# Altium schematic sheet Interface.SchDoc
size A4
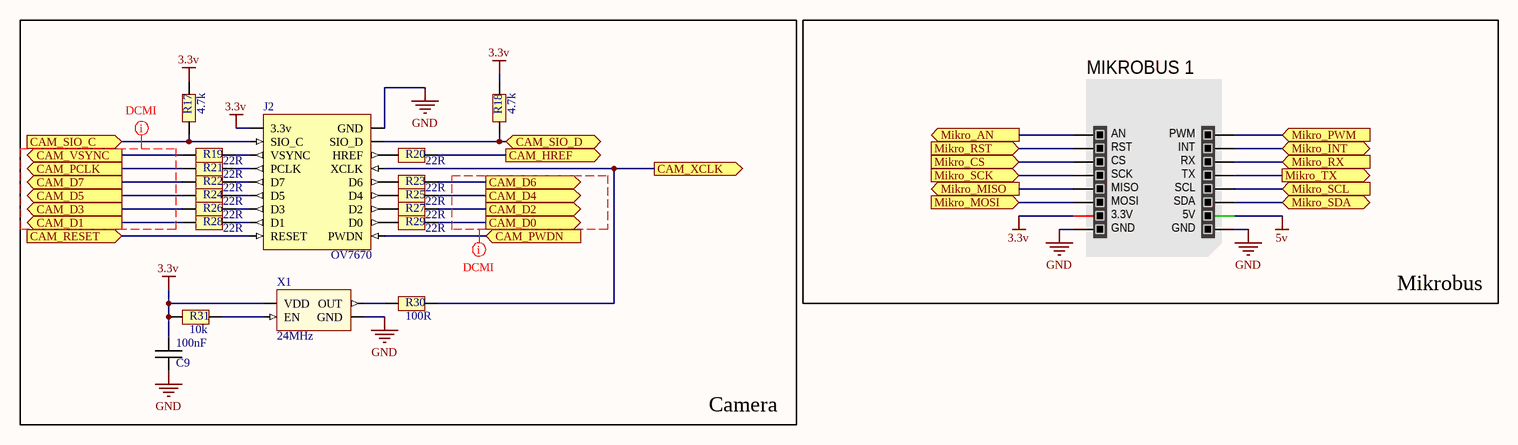
[diagram p0: Interface.SchDoc]

## Parts
C9  100nF  [0603]
J2  OV7670  [Header_2.54_2rang]
MIKROBUS_1  MIKROBUS HOST CONN.  [MIKROBUS HOST CONN.]  (value not drawn)
R17  4.7k  [0603]
R18  4.7k  [0603]
R19  22R  [0603]
R20  22R  [0603]
R21  22R  [0603]
R22  22R  [0603]
R23  22R  [0603]
R24  22R  [0603]
R25  22R  [0603]
R26  22R  [0603]
R27  22R  [0603]
R28  22R  [0603]
R29  22R  [0603]
R30  100R  [0603]
R31  10k  [0603]
X1  24MHz  [Oscillateur]

## Blocks framed on the sheet
Camera: C9 J2 R17-R31 X1
Mikrobus: MIKROBUS_1

## Ports
CAM_D0 (out), CAM_D1 (out), CAM_D2 (out), CAM_D3 (out), CAM_D4 (out), CAM_D5 (out), CAM_D6 (out), CAM_D7 (out), CAM_HREF (out), CAM_PCLK (out), CAM_PWDN (in), CAM_RESET (in), CAM_SIO_C (in), CAM_SIO_D (bidir), CAM_VSYNC (out), CAM_XCLK (out), Mikro_AN (out), Mikro_CS (in), Mikro_INT (bidir), Mikro_MISO (out), Mikro_MOSI (in), Mikro_PWM (in), Mikro_RST (in), Mikro_RX (in), Mikro_SCK (in), Mikro_SCL (in), Mikro_SDA (bidir), Mikro_TX (out)

## Nets
3.3v: C9.2 J2.1(3.3v) MIKROBUS_1.7(3.3V) R17.2 R18.2 R31.1 X1.4(VDD)
5v: MIKROBUS_1.10(5V)
GND: C9.1 J2.2(GND) MIKROBUS_1.8(GND) MIKROBUS_1.9(GND) X1.2(GND)
CAM_D0: R29.2 ; port CAM_D0
CAM_D1: R28.1 ; port CAM_D1
CAM_D2: R27.2 ; port CAM_D2
CAM_D3: R26.1 ; port CAM_D3
CAM_D4: R25.2 ; port CAM_D4
CAM_D5: R24.1 ; port CAM_D5
CAM_D6: R23.2 ; port CAM_D6
CAM_D7: R22.1 ; port CAM_D7
CAM_HREF: R20.2 ; port CAM_HREF
CAM_PCLK: R21.1 ; port CAM_PCLK
CAM_PWDN: J2.18(PWDN) ; port CAM_PWDN
CAM_RESET: J2.17(RESET) ; port CAM_RESET
CAM_SIO_C: J2.3(SIO_C) R17.1 ; port CAM_SIO_C
CAM_SIO_D: J2.4(SIO_D) R18.1 ; port CAM_SIO_D
CAM_VSYNC: R19.1 ; port CAM_VSYNC
CAM_XCLK: J2.8(XCLK) R30.2 ; port CAM_XCLK
Mikro_AN: MIKROBUS_1.1(AN) ; port Mikro_AN
Mikro_CS: MIKROBUS_1.3(CS) ; port Mikro_CS
Mikro_INT: MIKROBUS_1.15(INT) ; port Mikro_INT
Mikro_MISO: MIKROBUS_1.5(MISO) ; port Mikro_MISO
Mikro_MOSI: MIKROBUS_1.6(MOSI) ; port Mikro_MOSI
Mikro_PWM: MIKROBUS_1.16(PWM) ; port Mikro_PWM
Mikro_RST: MIKROBUS_1.2(RST) ; port Mikro_RST
Mikro_RX: MIKROBUS_1.14(RX) ; port Mikro_RX
Mikro_SCK: MIKROBUS_1.4(SCK) ; port Mikro_SCK
Mikro_SCL: MIKROBUS_1.12(SCL) ; port Mikro_SCL
Mikro_SDA: MIKROBUS_1.11(SDA) ; port Mikro_SDA
Mikro_TX: MIKROBUS_1.13(TX) ; port Mikro_TX
NetJ2_5: J2.5(VSYNC) R19.2
NetJ2_6: J2.6(HREF) R20.1
NetJ2_7: J2.7(PCLK) R21.2
NetJ2_9: J2.9(D7) R22.2
NetJ2_10: J2.10(D6) R23.1
NetJ2_11: J2.11(D5) R24.2
NetJ2_12: J2.12(D4) R25.1
NetJ2_13: J2.13(D3) R26.2
NetJ2_14: J2.14(D2) R27.1
NetJ2_15: J2.15(D1) R28.2
NetJ2_16: J2.16(D0) R29.1
NetR30_1: R30.1 X1.3(OUT)
NetR31_2: R31.2 X1.1(EN)

## Layout directives
rule Matched Net Lengths [Tolerance = 2mm]; net class DCMI: (no net found under the mark)

## Library data of the parts
C9 = Capa
J2 = OV7670: Manufacturer 1: Samtec; Manufacturer Part Number 1: SSW-109-01-T-D; Max Current Rating: 6.9A; Contact Resistance: 10mR; Connector Type: Receptacle,Socket; Number of Positions: 18; Gender: Receptacle; Max Voltage Rating (AC): 550V; Mating Cycles: 100; Pitch: 2.54mm; Row Spacing: 0.1inch; Supplier 1: Mouser; Stock 1: 163; Pricing 1: 1=1,58000, 10=1,31000, 100=0,98000, 250=0,92500, 500=0,81600, 1000=0,72400 (USD); RoHS: Yes; Mount: Through Hole; Contact Plating: Tin,Matte; Contact Material: Bronze; Color: Black; Housing Color: Black; Housing Material: Polymer; Min Operating Temperature: -55°C; Max Operating Temperature: 105°C; Packaging: Bulk; Termination: Solder; Number of Rows: 2; Number of Contacts: 18; Orientation: Vertical; Length: 23.37mm; Depth: 4.95mm; Width: 4.95mm; Radiation Hardening: No; REACH SVHC: No SVHC; Lead Free: Lead Free; ComponentLink1URL: https://datasheet.ciiva.com/750/ssw-1xx-xx-xxx-x-xx-xxx-xx-mkt-750020.pdf?src-supplier=Digi-Key; ComponentLink1Description: https://datasheet.ciiva.com/750/ssw-1xx-xx-xxx-x-xx-xxx-xx-mkt-750020.pdf?src-supplier=Digi-Key; Supplier Part Number 1: 200-SSW10901TD
MIKROBUS_1 = MIKROBUS HOST CONN._1: mikroBUS Host Socket; Manufacturer 1: Multicomp; Manufacturer Part Number 1: 2212S-08SG-85; Gender: Receptacle; Number of Contacts: 8; Insulation Resistance: 1GR; SMD: No; Supplier 1: Farnell; Stock 1: 60017; Pricing 1: 15=0,18900, 150=0,13900, 500=0,12000, 1000=0,09780, 1500=0,09440, 5000=0,09090, 10000=0,08730, 20000=0,08380 (EUR); RoHS: Yes; Mount: Through Hole; Weight: 0.11lb; Contact Plating: Gold; Contact Material: Copper Alloy; Number of Rows: 1; Termination: Through Hole; Length: 0.83inch; Height: 0.35inch; Width: 0.12inch; REACH SVHC: No SVHC; Flammability Rating: UL94 V-0; ComponentLink1URL: https://datasheet.ciiva.com/1434/1662126-1434005.pdf?src-supplier=Element14; ComponentLink1Description: https://datasheet.ciiva.com/1434/1662126-1434005.pdf?src-supplier=Element14; Supplier Part Number 1: 1593463
R17-R31 = Resistance
X1 = Oscillateur: Manufacturer 1: Kyocera AVX; Manufacturer Part Number 1: KC2520B24.0000C10E00; Load Capacitance: 15pF; Max Supply Voltage: 3.63V; Min Supply Voltage: 1.6V; Frequency Tolerance: 50ppm; Current Rating: 3.5mA; Max Duty Cycle: 55%; Supplier 1: Mouser; Stock 1: 7192; Pricing 1: 1=1,34000, 10=1,28000, 50=1,26000, 100=1,07000, 500=1,04000, 1000=0,84100, 2000=0,79800, 10000=0,79600 (USD); RoHS: Yes; Mount: Surface Mount; Case/Package: CSMD; Number of Pins: 4; Min Operating Temperature: -10°C; Max Operating Temperature: 70°C; Packaging: Tape and Reel; Frequency: 24MHz; Package Quantity: 2000; Frequency Stability: 50ppm; Termination: SMD/SMT; Max Supply Current: 3.5mA; Length: 2.5mm; Height: 0.028inch; Width: 2mm; Depth: 2mm; Radiation Hardening: No; REACH SVHC: Unknown; Lead Free: Lead Free; ComponentLink1URL: https://datasheet.ciiva.com/7061/1794171-7061531.pdf?src-supplier=Newark; ComponentLink1Description: https://datasheet.ciiva.com/7061/1794171-7061531.pdf?src-supplier=Newark; Supplier Part Number 1: 581-KC2520B24.0C10